# Altium schematic sheet UART Comm Isolation.SchDoc: UART Isolation
size 292 x 193 mm; SheetNumber: 6; SheetTotal: 12
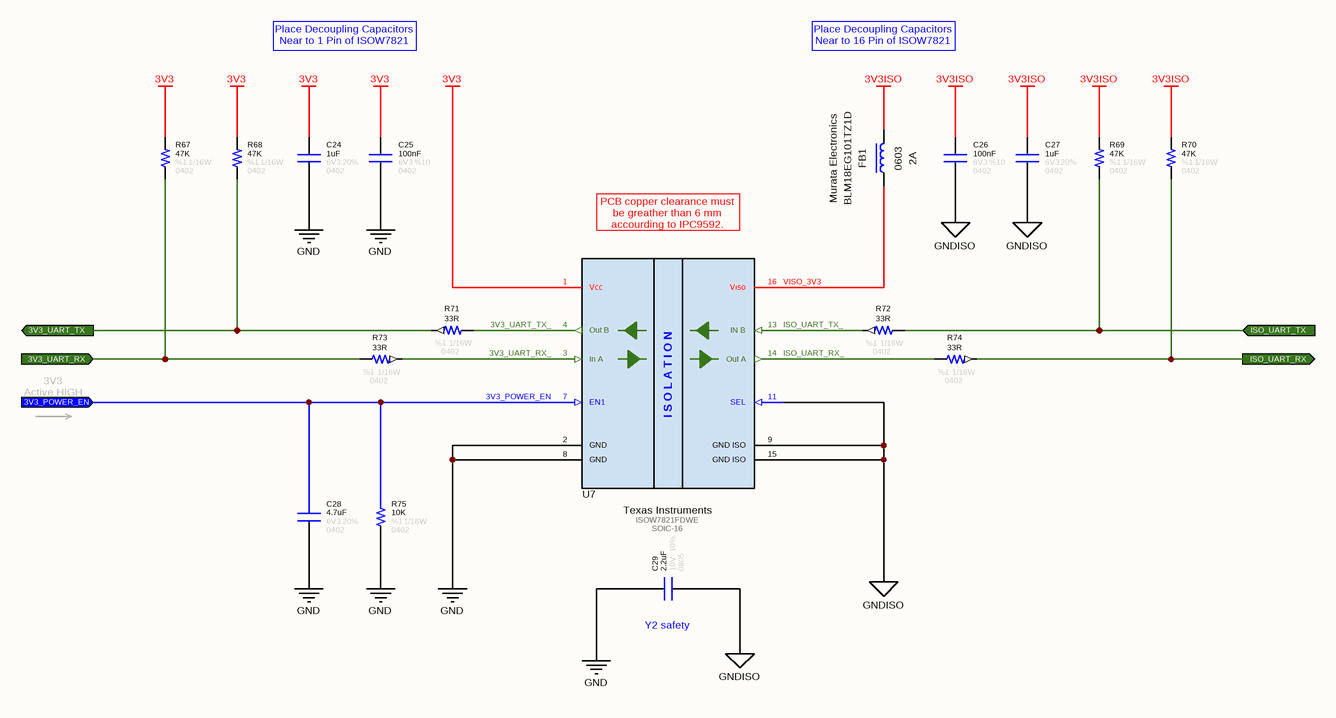
[diagram p0: UART Comm Isolation.SchDoc]

## Parts
C24  value 1uF  Tolerance: 20%  Case: 0402  Voltage: 6V3  [CAPACITOR_0402]  (hidden comment: Capacitor - 1uF [0402] (MLCC))
C25  value 100nF  Tolerance: %10  Voltage: 6V3  Case: 0402  [CAPACITOR_0402]  (hidden comment: Capacitor - 100nF [0402] (Ceramic))
C26  value 100nF  Tolerance: %10  Voltage: 6V3  Case: 0402  [CAPACITOR_0402]  (hidden comment: Capacitor - 100nF [0402] (Ceramic))
C27  value 1uF  Tolerance: 20%  Case: 0402  Voltage: 6V3  [CAPACITOR_0402]  (hidden comment: Capacitor - 1uF [0402] (MLCC))
C28  value 4.7uF  Tolerance: 20%  Case: 0402  Voltage: 6V3  [CAPACITOR_0402]  (hidden comment: Capacitor - 4.7uF [0402] (Ceramic))
C29  value 2.2uF  Tolerance: 10%  Case: 0805  Voltage: 10V  [CAPACITOR_0805]  (hidden comment: Capacitor - 2.2uF [0805] (MLCC))
FB1  Maximum DC Current: 2A  Case: 0603  Manufacturer Part Number: BLM18EG101TZ1D  Manufacturer Name: Murata Electronics  [INDUCTOR_0603]  (hidden comment: Ferrite Bead)
R67  value 47K  Tolerance: %1  Case: 0402  Power: 1/16W  [RESISTOR_0402]  (hidden comment: 47K - 0402 - %1 - 1/16W)
R68  value 47K  Tolerance: %1  Case: 0402  Power: 1/16W  [RESISTOR_0402]  (hidden comment: 47K - 0402 - %1 - 1/16W)
R69  value 47K  Tolerance: %1  Case: 0402  Power: 1/16W  [RESISTOR_0402]  (hidden comment: 47K - 0402 - %1 - 1/16W)
R70  value 47K  Tolerance: %1  Case: 0402  Power: 1/16W  [RESISTOR_0402]  (hidden comment: 47K - 0402 - %1 - 1/16W)
R71  value 33R  Case: 0402  Tolerance: %1  Power: 1/16W  [RESISTOR_0402]  (hidden comment: 33R - 0402 - %1 - 1/16W)
R72  value 33R  Case: 0402  Tolerance: %1  Power: 1/16W  [RESISTOR_0402]  (hidden comment: 33R - 0402 - %1 - 1/16W)
R73  value 33R  Case: 0402  Tolerance: %1  Power: 1/16W  [RESISTOR_0402]  (hidden comment: 33R - 0402 - %1 - 1/16W)
R74  value 33R  Case: 0402  Tolerance: %1  Power: 1/16W  [RESISTOR_0402]  (hidden comment: 33R - 0402 - %1 - 1/16W)
R75  value 10K  Tolerance: %1  Case: 0402  Power: 1/16W  [RESISTOR_0402]  (hidden comment: 10K - 0402 - %1 - 1/16W)
U7  Manufacturer Name: Texas Instruments  Manufacturer Part Number: ISOW7821FDWE  Case: SOIC-16  [SOIC-16 DW]  (hidden comment: ISOW7821)

## Ports
3V3_POWER_EN (in), 3V3_UART_RX (in), 3V3_UART_TX (out), ISO_UART_RX (out), ISO_UART_TX (in)

## Nets
3V3: C24.2 C25.2 R67.2 R68.2 U7.1(Vcc)
3V3ISO: C26.2 C27.2 FB1.2 R69.2 R70.2
GND: C24.1 C25.1 C28.1 C29.2 R75.1 U7.2(GND) U7.8(GND)
GNDISO: C26.1 C27.1 C29.1 U7.9(GND_ISO) U7.11(SEL) U7.15(GND_ISO)
3V3_POWER_EN: C28.2 R75.2 U7.7(EN1) ; port 3V3_POWER_EN
3V3_UART_RX: R67.1 R73.2 ; port 3V3_UART_RX
3V3_UART_RX_: R73.1 U7.3(In_A)
3V3_UART_TX: R68.1 R71.2 ; port 3V3_UART_TX
3V3_UART_TX_: R71.1 U7.4(Out_B)
ISO_UART_RX: R70.1 R74.1 ; port ISO_UART_RX
ISO_UART_RX_: R74.2 U7.14(Out_A)
ISO_UART_TX: R69.1 R72.1 ; port ISO_UART_TX
ISO_UART_TX_: R72.2 U7.13(IN_B)
VISO_3V3: FB1.1 U7.16(Viso)

Not connected (* = marked no-connect by the designer): U7 5(NC) 6(NC) 10(NC) 12(NC)

## Notes on the sheet
- Place Decoupling Capacitors Near to 1 Pin of ISOW7821
- Place Decoupling Capacitors Near to 16 Pin of ISOW7821
- PCB copper clearance must be greather than 6 mm accourding to IPC9592.
- 3V3
  Active HIGH
- (near C29) Y2 safety
- © 2021 All rights reserved.
  This document may not, in whole or in part, be copied, photocopied, reproduced, translated or converted to any electronic or machine readable from without prior written permission of Mehmet Günce Akkoyun.
  Engineer contact : akkoyun@me.com
- Property of
- Engineer :
- Date :
- Size :
- A4
- Time :
- Project :
- Page :
- /
- Customer :
- Product ID :
- Module ID :
- Version :
- File :
- Revision :
- (in symbol IC - ISOW7821) I S O L A T I O N

## Library data of the parts
C24 C27 = Capacitor - 1uF [0402-6V3]: Capacitor (MLCC) - 1uF / 6V3 / 0402; Manufacturer Part Number: GRM153R60J105ME95D; Manufacturer Name: Murata Electronics; ComponentLink1Description: DataSheet; ComponentLink1URL: https://www.mouser.com.tr/datasheet/2/281/murata_03052018_GRM_Series_1-1310166.pdf; ComponentLink2Description: Mouser; ComponentLink2URL: https://www.mouser.com.tr/ProductDetail/Murata-Electronics/GRM153R60J105ME95D?qs=eeBpzGFlv%252B8jOnvCVAGQrQ%3D%3D; Subcategory: Capacitors
C25 C26 = Capacitor - 100nF [0402-6V3]: Capacitor - 100nF [0402-6V3] (Ceramic); Manufacturer Name: AVX; Manufacturer Part Number: 04026D104KAT4A; ComponentLink1Description: Mouser; ComponentLink1URL: https://www.mouser.com.tr/ProductDetail/AVX/04026D104KAT4A?qs=sGAEpiMZZMs0AnBnWHyRQPg4iYkCw7IMED%2F4kpqgf7w%3D; ComponentLink2Description: DataSheet; ComponentLink2URL: https://www.mouser.com.tr/datasheet/2/40/cx5r-776519.pdf
C28 = Capacitor - 4.7uF [0402-6V3]: Multilayer Ceramic Capacitors - SMD - 6V3 4.7uF X5R 0402 20%; Manufacturer Part Number: C0402C475M9PACTU; Manufacturer Name: KEMET
C29 = Capacitor - 2.2uF [0805-10V]: Multilayer Ceramic Capacitors MLCC - SMD/SMT WCAP-CSGP 2.2uF 0805 10% 10V MLCC; Manufacturer Part Number: 885012207024; Manufacturer Name: Wurth Elektronik; Subcategory: Capacitors
FB1 = Inductor - Ferrite Bead [SMD]: Ferrite Beads 0603 100ohms 2000mA Auto Infotainment; Maximum DC Resistance: 45 mOhms; Tolerance: 25%; Value: BLM18EG101TZ1D; Height: 0.75mm; Maximum Operating Temperature: + 125; Minimum Operating Temperature: -55
R67-R70 = Resistor - 47K [0402]: Thick Film Resistors - SMD 1/16 W 47 KOhm 1%; Manufacturer Name: Vishay; Manufacturer Part Number: CRCW040247K0FKED; ComponentLink1Description: DataSheet; ComponentLink1URL: https://www.mouser.com.tr/datasheet/2/427/dcrcwe3-1762152.pdf; ComponentLink2Description: Mouser; ComponentLink2URL: https://www.mouser.com.tr/ProductDetail/Vishay-Dale/CRCW040247K0FKED?qs=sGAEpiMZZMu61qfTUdNhG2DpbjADlD3GL%252B3h1elTxqU%3D
R71-R74 = Resistor - 33R [0402]: Thick Film Resistors - SMD 1/16 W 33 Ohm 1%; Manufacturer Name: Vishay; Manufacturer Part Number: CRCW040233R0FKED; ComponentLink1Description: DataSheet; ComponentLink1URL: https://www.mouser.com.tr/datasheet/2/427/dcrcwe3-1762152.pdf; ComponentLink2Description: Mouser; ComponentLink2URL: https://www.mouser.com.tr/ProductDetail/Vishay-Dale/CRCW0402330RFKED?qs=sGAEpiMZZMu61qfTUdNhG2DpbjADlD3GGS6SwBlLi5Q%3D
R75 = Resistor - 10K [0402]: Thick Film Resistors - SMD 1/16 W 10 KOhm 1%; Manufacturer Name: Vishay; Manufacturer Part Number: CRCW040210K0FKED; ComponentLink1Description: DataSheet; ComponentLink1URL: https://www.mouser.com.tr/datasheet/2/427/dcrcwe3-1762152.pdf; ComponentLink2Description: Mouser; ComponentLink2URL: https://www.mouser.com.tr/ProductDetail/Vishay-Dale/CRCW040210K0FKED?qs=sGAEpiMZZMu61qfTUdNhG2DpbjADlD3GcalbOv9utCY%3D
U7 = IC - ISOW7821: Digital Isolators Dual-channel 1/1 r einforced digital is A 595-ISOW7821FDWER; Isolation Voltage: 5000 Vrms; Supply Voltage - Min: 3 V; Supply Voltage - Max: 5V5